# EAGLE schematic 8051 (EAGLE 7.2.0)
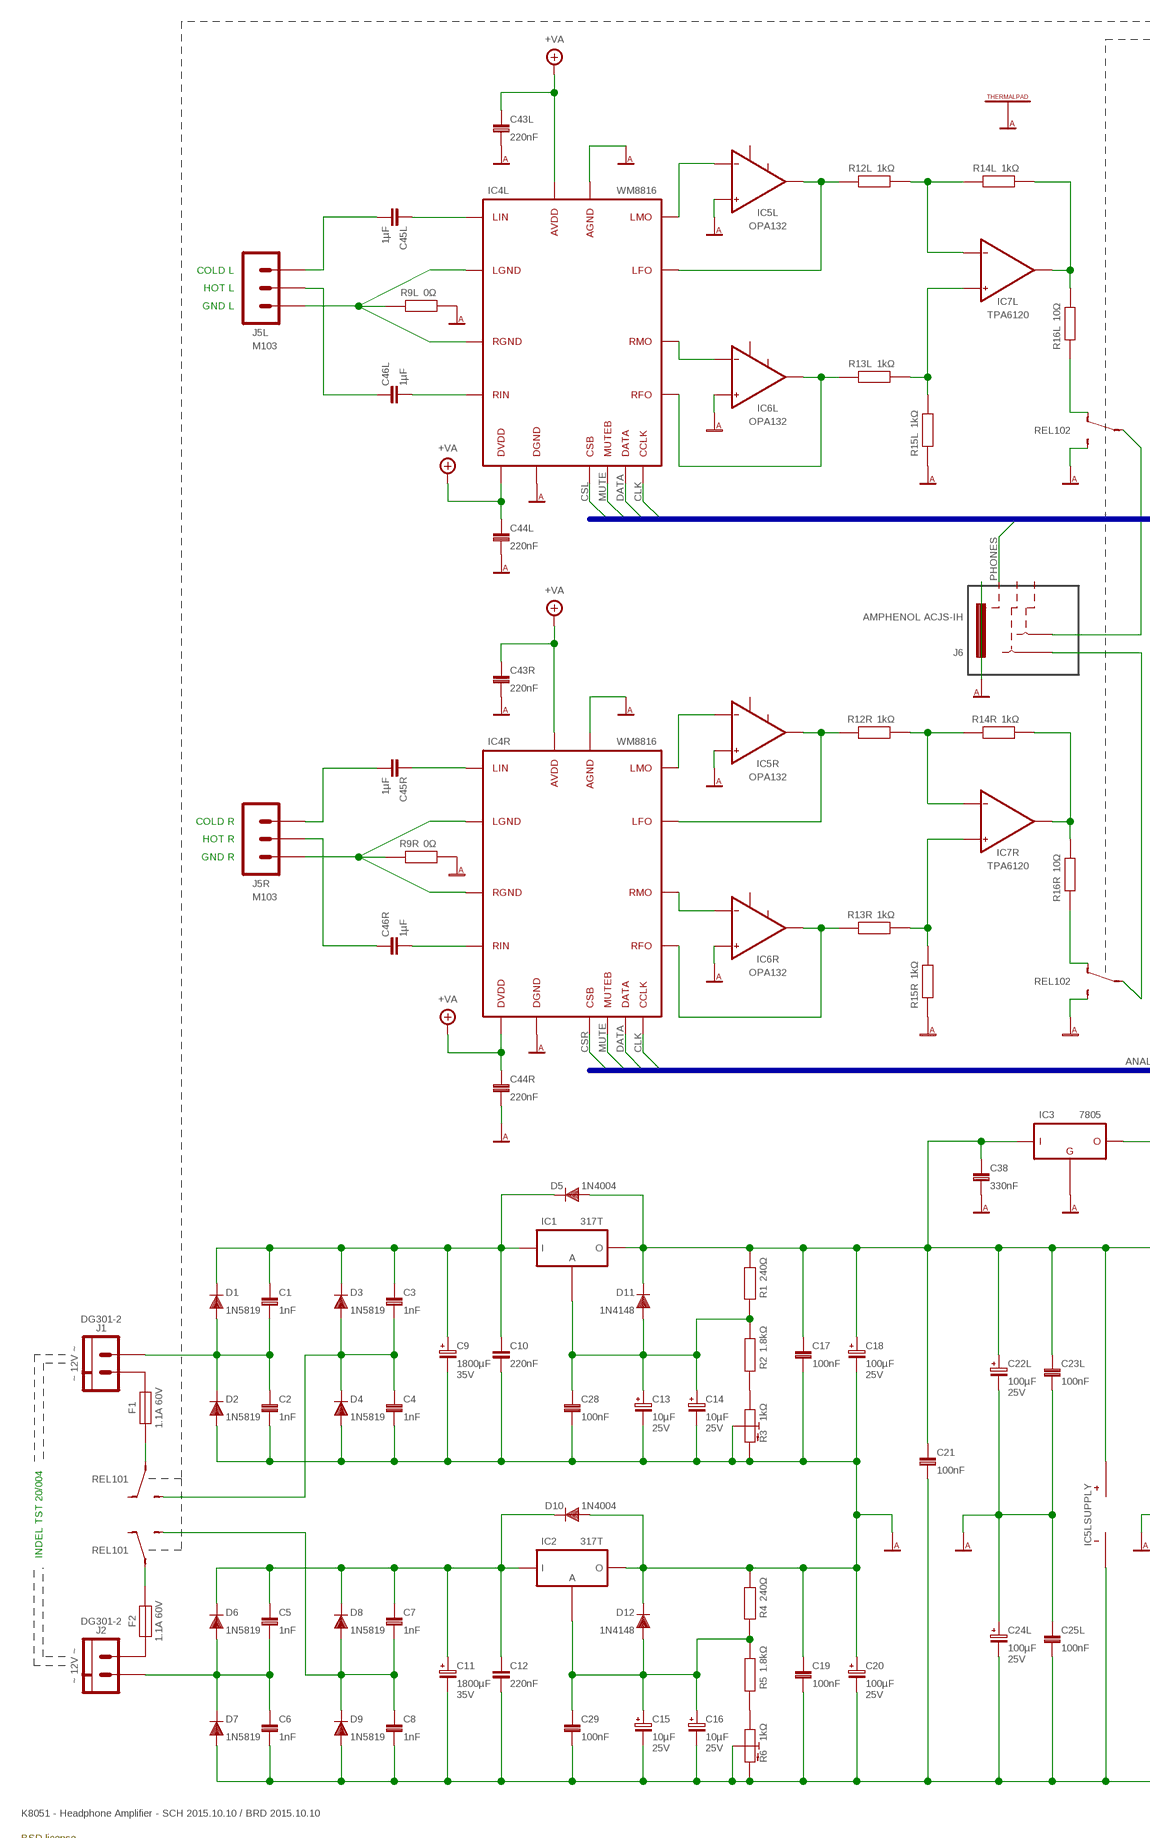
[diagram p0: schematic, sheet 1, part 1 of 2]
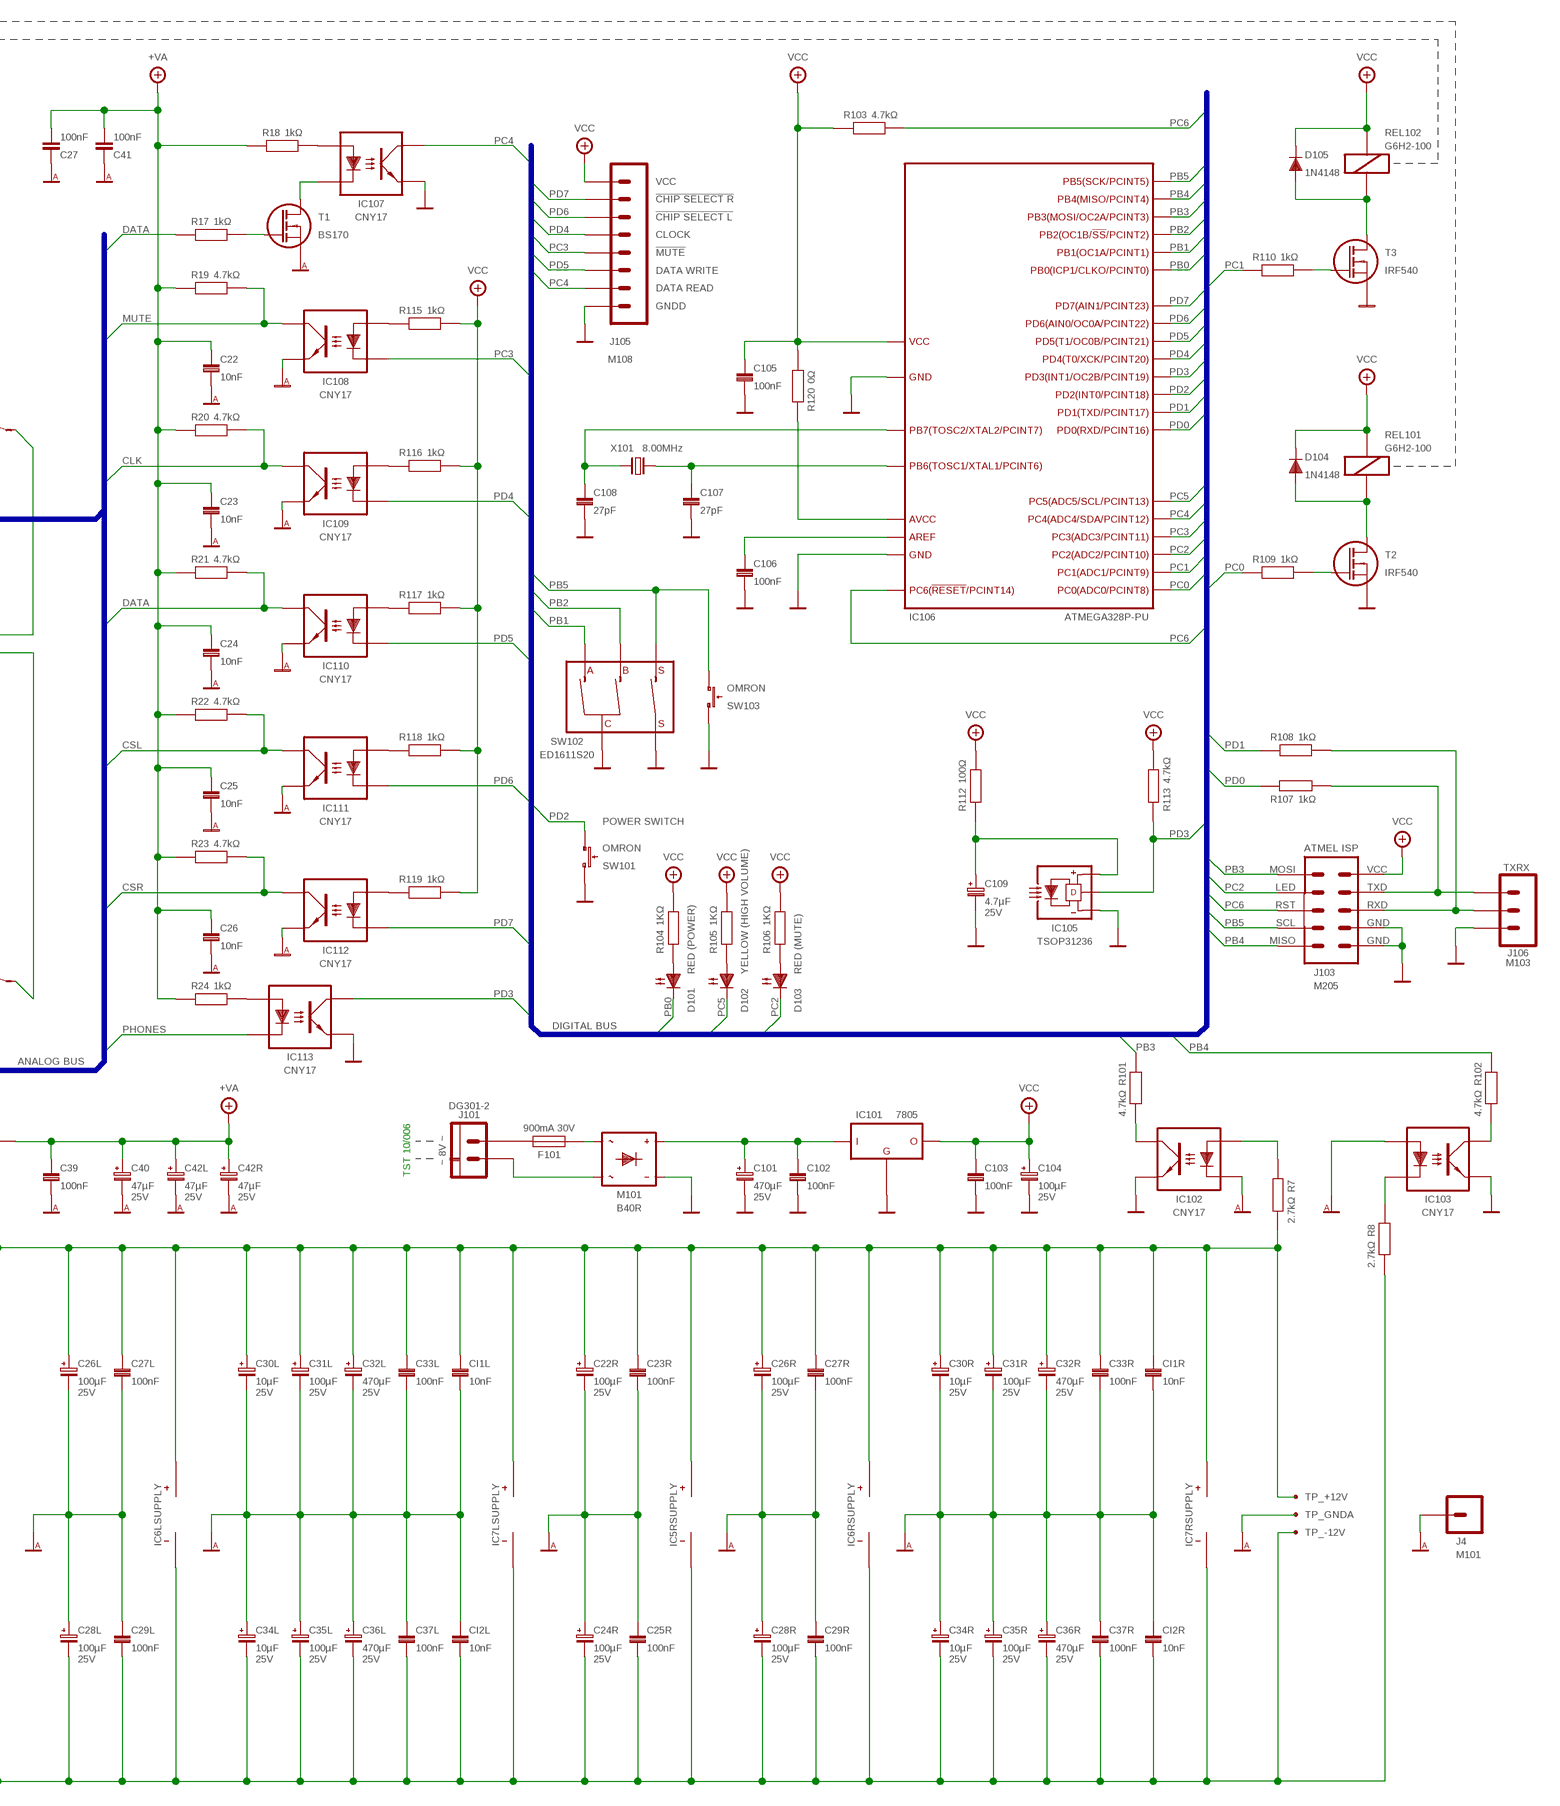
[diagram p1: schematic, sheet 1, part 2 of 2]

## Parts
C1  1nF  C075-032X103  [C075-032X103]
C2  1nF  C075-032X103  [C075-032X103]
C3  1nF  C075-032X103  [C075-032X103]
C4  1nF  C075-032X103  [C075-032X103]
C5  1nF  C075-032X103  [C075-032X103]
C6  1nF  C075-032X103  [C075-032X103]
C7  1nF  C075-032X103  [C075-032X103]
C8  1nF  C075-032X103  [C075-032X103]
C9  1800µF  FM1V182  [E-160-250-075-08]
C10  220nF  C102-064X133  [C102-064X133]
C11  1800µF  FM1V182  [E-160-250-075-08]
C12  220nF  C102-064X133  [C102-064X133]
C13  10µF  FM1E470  [E-050-110-020-05]
C14  10µF  FM1E470  [E-050-110-020-05]
C15  10µF  FM1E470  [E-050-110-020-05]
C16  10µF  FM1E470  [E-050-110-020-05]
C17  100nF  C075-042X103  [C075-042X103]
C18  100µF  FM1E101  [E-063-112-025-05]
C19  100nF  C075-042X103  [C075-042X103]
C20  100µF  FM1E101  [E-063-112-025-05]
C21  100nF  C075-042X103  [C075-042X103]
C22  10nF  CC0805  [C0805]
C22L  100µF  FM1E101  [E-063-112-025-05]
C22R  100µF  FM1E101  [E-063-112-025-05]
C23  10nF  CC0805  [C0805]
C23L  100nF  C075-042X103  [C075-042X103]
C23R  100nF  C075-042X103  [C075-042X103]
C24  10nF  CC0805  [C0805]
C24L  100µF  FM1E101  [E-063-112-025-05]
C24R  100µF  FM1E101  [E-063-112-025-05]
C25  10nF  CC0805  [C0805]
C25L  100nF  C075-042X103  [C075-042X103]
C25R  100nF  C075-042X103  [C075-042X103]
C26  10nF  CC0805  [C0805]
C26L  100µF  FM1E101  [E-063-112-025-05]
C26R  100µF  FM1E101  [E-063-112-025-05]
C27  100nF  C075-042X103  [C075-042X103]
C27L  100nF  C075-042X103  [C075-042X103]
C27R  100nF  C075-042X103  [C075-042X103]
C28  100nF  CC1812  [C1812]
C28L  100µF  FM1E101  [E-063-112-025-05]
C28R  100µF  FM1E101  [E-063-112-025-05]
C29  100nF  CC1812  [C1812]
C29L  100nF  C075-042X103  [C075-042X103]
C29R  100nF  C075-042X103  [C075-042X103]
C30L  10µF  FM1E470  [E-050-110-020-05]
C30R  10µF  FM1E470  [E-050-110-020-05]
C31L  100µF  FM1E101  [E-063-112-025-05]
C31R  100µF  FM1E101  [E-063-112-025-05]
C32L  470µF  FM1E471  [E-100-160-050-06]
C32R  470µF  FM1E471  [E-100-160-050-06]
C33L  100nF  C075-042X103  [C075-042X103]
C33R  100nF  C075-042X103  [C075-042X103]
C34L  10µF  FM1E470  [E-050-110-020-05]
C34R  10µF  FM1E470  [E-050-110-020-05]
C35L  100µF  FM1E101  [E-063-112-025-05]
C35R  100µF  FM1E101  [E-063-112-025-05]
C36L  470µF  FM1E471  [E-100-160-050-06]
C36R  470µF  FM1E471  [E-100-160-050-06]
C37L  100nF  C075-042X103  [C075-042X103]
C37R  100nF  C075-042X103  [C075-042X103]
C38  330nF  CC1206  [C1206]
C39  100nF  CC1206  [C1206]
C40  47µF  FM1E470  [E-050-110-020-05]
C41  100nF  C075-042X103  [C075-042X103]
C42L  47µF  FM1E470  [E-050-110-020-05]
C42R  47µF  FM1E470  [E-050-110-020-05]
C43L  220nF  C102-064X133  [C102-064X133]
C43R  220nF  C102-064X133  [C102-064X133]
C44L  220nF  C102-064X133  [C102-064X133]
C44R  220nF  C102-064X133  [C102-064X133]
C45L  1µF  C075-063X106  [C075-063X106]
C45R  1µF  C075-063X106  [C075-063X106]
C46L  1µF  C075-063X106  [C075-063X106]
C46R  1µF  C075-063X106  [C075-063X106]
C101  470µF  FM1E471  [E-100-160-050-06]
C102  100nF  CC1206  [C1206]
C103  100nF  CC1206  [C1206]
C104  100µF  FM1E101  [E-063-112-025-05]
C105  100nF  CC1206  [C1206]
C106  100nF  CC1206  [C1206]
C107  27pF  CC1206  [C1206]
C108  27pF  CC1206  [C1206]
C109  4.7µF  FM1E470  [E-050-110-020-05]
CI1L  10nF  CC0805K  [C0805K]
CI1R  10nF  CC0805K  [C0805K]
CI2L  10nF  CC0805K  [C0805K]
CI2R  10nF  CC0805K  [C0805K]
D1  1N5819  1N4004  [DO41-10]
D2  1N5819  1N4004  [DO41-10]
D3  1N5819  1N4004  [DO41-10]
D4  1N5819  1N4004  [DO41-10]
D5  1N4004  [DO41-10]
D6  1N5819  1N4004  [DO41-10]
D7  1N5819  1N4004  [DO41-10]
D8  1N5819  1N4004  [DO41-10]
D9  1N5819  1N4004  [DO41-10]
D10  1N4004  [DO41-10]
D11  1N4148  1N4148DO35-7  [DO35-7]
D12  1N4148  1N4148DO35-7  [DO35-7]
D101  RED (POWER)  LED3MM  [LED3MM]
D102  YELLOW (HIGH VOLUME)  LED3MM  [LED3MM]
D103  RED (MUTE)  LED3MM  [LED3MM]
D104  1N4148  1N4148DO35-7  [DO35-7]
D105  1N4148  1N4148DO35-7  [DO35-7]
F1  1.1A 60V  FUSE-LITTELFUSE-60R110  [LITTELFUSE-60R110]
F2  1.1A 60V  FUSE-LITTELFUSE-60R110  [LITTELFUSE-60R110]
F101  900mA 30V  FUSE-LITTELFUSE-30R090  [LITTELFUSE-30R090]
IC1  317T  LM317TS  [TO220]
IC2  317T  LM317TS  [TO220]
IC3  7805  LM78XX-C  [TO220]
IC4L  WM8816  [SO16W]
IC4R  WM8816  [SO16W]
IC5L  OPA132  [DIL08]
IC5R  OPA132  [DIL08]
IC6L  OPA132  [DIL08]
IC6R  OPA132  [DIL08]
IC7  TPA6120  [SO20-POWERPAD]
IC101  7805  LM78XX-C  [TO220]
IC102  CNY17  CNY17F  [DIL06]
IC103  CNY17  CNY17F  [DIL06]
IC105  TSOP31236  TSOP1736  [TSOP17XX]
IC106  ATMEGA328P-PU  [DIP254P800X550-28B]
IC107  CNY17  CNY17F  [DIL06]
IC108  CNY17  CNY17F  [DIL06]
IC109  CNY17  CNY17F  [DIL06]
IC110  CNY17  CNY17F  [DIL06]
IC111  CNY17  CNY17F  [DIL06]
IC112  CNY17  CNY17F  [DIL06]
IC113  CNY17  CNY17F  [DIL06]
J1  DG301-2  [DG301-2]
J2  DG301-2  [DG301-2]
J4  M101  1-1  [1-1]
J5L  M103  1-3  [1-3]
J5R  M103  1-3  [1-3]
J6  AMPHENOL ACJS-IH  JACK-FEMALE-STEREO  [JACK-FEMALE-STEREO]
J101  DG301-2  [DG301-2]
J103  M205  ATMEL-ISP-10-RXTX-V  [MM-10-V]
J105  M108  1-8  [1-8]
J106  M103  1-3  [1-3]
M101  B40R  B40C1500R  [RB1A]
R1  240Ω  RR1206  [R1206]
R2  1.8kΩ  RR1206  [R1206]
R3  1kΩ  POTB64Y  [POT_B64Y]
R4  240Ω  RR1206  [R1206]
R5  1.8kΩ  RR1206  [R1206]
R6  1kΩ  POTB64Y  [POT_B64Y]
R7  2.7kΩ  RR1206  [R1206]
R8  2.7kΩ  RR1206  [R1206]
R9L  0Ω  R0204/5  [0204/5]
R9R  0Ω  R0204/5  [0204/5]
R12L  1kΩ  R0204/5  [0204/5]
R12R  1kΩ  R0204/5  [0204/5]
R13L  1kΩ  R0204/5  [0204/5]
R13R  1kΩ  R0204/5  [0204/5]
R14L  1kΩ  R0204/5  [0204/5]
R14R  1kΩ  R0204/5  [0204/5]
R15L  1kΩ  R  [TPA_RF]
R15R  1kΩ  R  [TPA_RF]
R16L  10Ω  R0204/5  [0204/5]
R16R  10Ω  R0204/5  [0204/5]
R17  1kΩ  RR1206  [R1206]
R18  1kΩ  RR1206  [R1206]
R19  4.7kΩ  RR1206  [R1206]
R20  4.7kΩ  RR1206  [R1206]
R21  4.7kΩ  RR1206  [R1206]
R22  4.7kΩ  RR1206  [R1206]
R23  4.7kΩ  RR1206  [R1206]
R24  1kΩ  RR1206  [R1206]
R101  4.7kΩ  RR1206  [R1206]
R102  4.7kΩ  RR1206  [R1206]
R103  4.7kΩ  RR1206  [R1206]
R104  1KΩ  RR1206  [R1206]
R105  1KΩ  RR1206  [R1206]
R106  1KΩ  RR1206  [R1206]
R107  1kΩ  RR1206  [R1206]
R108  1kΩ  RR1206  [R1206]
R109  1kΩ  RR1206  [R1206]
R110  1kΩ  RR1206  [R1206]
R112  100Ω  RR1206  [R1206]
R113  4.7kΩ  RR1206  [R1206]
R115  1kΩ  RR1206  [R1206]
R116  1kΩ  RR1206  [R1206]
R117  1kΩ  RR1206  [R1206]
R118  1kΩ  RR1206  [R1206]
R119  1kΩ  RR1206  [R1206]
R120  0Ω  RR1206  [R1206]
REL101  G6H2-100  [G6H2-100]
REL102  G6H2-100  [G6H2-100]
SW101  OMRON  10-XXVERT  [B3F-31XX]
SW102  ED1611S20  [ED1611S-20]
SW103  OMRON  10-XXVERT  [B3F-31XX]
T1  BS170  BS170BENT  [TO92-DGS-BENT]
T2  IRF540  [TO220-GDS]
T3  IRF540  [TO220-GDS]
TP_+12V  TP  [TP]
TP_-12V  TP  [TP]
TP_GNDA  TP  [TP]
X101  8.00MHz  CRYSTALHC49S  [HC49/S]

## Nets
+VA: C22.1 C23.1 C24.1 C25.1 C26.1 C27.2 C39.1 C40.+ C41.2 C42L.+ C42R.+ C43L.1 C43R.1 C44L.1 C44R.1 IC3.3(OUT) IC4L.1(AVDD) IC4L.7(DVDD) IC4R.1(AVDD) IC4R.7(DVDD) R18.1 R19.1 R20.1 R21.1 R22.1 R23.1 R24.1
AUDIOIN_LC [ANALOG_LO]: C45L.2 J5L.1
AUDIOIN_LGND [ANALOG_LO]: IC4L.5(LGND) IC4L.12(RGND) J5L.3 R9L.1
AUDIOIN_LH [ANALOG_LO]: C46L.1 J5L.2
AUDIOIN_RC [ANALOG_LO]: C45R.2 J5R.1
AUDIOIN_RGND [ANALOG_LO]: IC4R.5(LGND) IC4R.12(RGND) J5R.3 R9R.1
AUDIOIN_RH [ANALOG_LO]: C46R.1 J5R.2
AVCC [DIGITAL_SUPPLY]: IC106.20(AVCC) R120.1
CLK [ANALOG]: IC4L.10(CCLK) IC4R.10(CCLK) IC109.5(COL) R20.2
CSL [ANALOG]: IC4L.6(CSB) IC111.5(COL) R22.2
CSR [ANALOG]: IC4R.6(CSB) IC112.5(COL) R23.2
DATA [ANALOG]: IC4L.9(DATA) IC4R.9(DATA) IC110.5(COL) R17.1 R21.2
GND [DIGITAL_SUPPLY]: C101.- C102.2 C103.2 C104.- C105.2 C106.2 C107.2 C108.2 C109.- IC101.2(GND) IC102.4(EMIT) IC103.4(EMIT) IC105.GND IC106.8(GND) IC106.22(GND) IC107.4(EMIT) IC113.4(EMIT) J103.8(GND) J103.10(GND) J105.1 J106.1 M101.- SW101.2(S) SW102.C SW102.S2 SW103.2(S) T2.S T3.S
GNDA [ANALOG]: C2.2 C4.2 C9.- C10.1 C13.- C14.- C17.2 C18.- C19.1 C20.+ C22.2 C22L.- C22R.- C23.2 C23L.2 C23R.2 C24.2 C24L.+ C24R.+ C25.2 C25L.1 C25R.1 C26.2 C26L.- C26R.- C27.1 C27L.2 C27R.2 C28.2 C28L.+ C28R.+ C29L.1 C29R.1 C30L.- C30R.- C31L.- C31R.- C32L.- C32R.- C33L.2 C33R.2 C34L.+ C34R.+ C35L.+ C35R.+ C36L.+ C36R.+ C37L.1 C37R.1 C38.2 C39.2 C40.- C41.1 C42L.- C42R.- C43L.2 C43R.2 C44L.2 C44R.2 CI1L.2 CI1R.2 CI2L.1 CI2R.1 D2.A D4.A D10.A D12.C IC2.2(OUT) IC3.2(GND) IC4L.11(DGND) IC4L.16(AGND) IC4R.11(DGND) IC4R.16(AGND) IC5L.3(+IN) IC5R.3(+IN) IC6L.3(+IN) IC6R.3(+IN) IC7.THERMAL(TPAD:THERMAL) IC102.2(C) IC103.1(A) IC108.4(EMIT) IC109.4(EMIT) IC110.4(EMIT) IC111.4(EMIT) IC112.4(EMIT) J4.1 J6.G R3.E R3.S R4.2 R9L.2 R9R.2 R15L.1 R15R.1 REL102.S1(2:S) REL102.S2(3:S) T1.S TP_GNDA.P$1
LFO_L [ANALOG_LO]: IC4L.3(LFO) IC5L.6(OUT) R12L.1
LFO_R [ANALOG_LO]: IC4R.3(LFO) IC5R.6(OUT) R12R.1
LIN_L [ANALOG_LO]: C45L.1 IC4L.4(LIN)
LIN_R [ANALOG_LO]: C45R.1 IC4R.4(LIN)
LMO_L [ANALOG]: IC4L.2(LMO) IC5L.2(-IN)
LMO_R [ANALOG]: IC4R.2(LMO) IC5R.2(-IN)
MUTE [ANALOG]: IC4L.8(MUTEB) IC4R.8(MUTEB) IC108.5(COL) R19.2
N$1 [DIGITAL_SIGNAL]: R110.2 T3.G
N$6: C106.1 IC106.21(AREF)
N$8 [ANALOG]: C15.+ C16.+ C29.1 D12.A IC2.1(ADJ) R4.1 R5.1
N$9 [ANALOG]: R5.2 R6.A
N$21: D103.A R106.1
N$23 [DIGITAL_SIGNAL]: C109.+ IC105.V+ R112.1
N$24 [DIGITAL_SUPPLY]: F101.2 M101.AC@1(~)
N$25 [DIGITAL_SUPPLY]: J101.1 M101.AC@2(~)
N$26: IC107.1(A) R18.2
N$27 [ANALOG]: C13.+ C14.+ C28.1 D11.A IC1.1(ADJ) R1.1 R2.1
N$32 [DIGITAL_SIGNAL]: D105.A REL102.10 T3.D
N$33 [ANALOG]: C1.2 C2.1 D1.A D2.C J1.2
N$35 [ANALOG]: C5.2 C6.1 D6.A D7.C J2.1
N$36 [ANALOG]: C7.2 C8.1 D8.A D9.C REL101.S1(2:S)
N$38 [ANALOG]: C5.1 C7.1 C11.+ C12.2 D6.C D8.C D10.C IC2.3(IN)
N$39 [ANALOG]: R2.2 R3.A
N$48 [ANALOG]: C1.1 C3.1 C9.+ C10.2 D1.C D3.C D5.C IC1.3(IN)
N$49 [ANALOG]: F1.1 REL101.P2(3:P)
N$50 [DIGITAL_SIGNAL]: C107.1 IC106.9(PB6) X101.1
N$52 [DIGITAL_SIGNAL]: C108.1 IC106.10(PB7) X101.2
N$53 [ANALOG]: C3.2 C4.1 D3.A D4.C REL101.S2(3:S)
N$54 [DIGITAL_SIGNAL]: IC111.1(A) R118.1
N$55 [DIGITAL_SIGNAL]: IC110.1(A) R117.1
N$56 [DIGITAL_SIGNAL]: IC109.1(A) R116.1
N$57 [DIGITAL_SIGNAL]: IC108.1(A) R115.1
N$58 [DIGITAL_SIGNAL]: IC112.1(A) R119.1
N$60 [DIGITAL_SIGNAL]: R109.2 T2.G
N$61 [DIGITAL_SIGNAL]: J103.4(TXD) J106.3 R107.2
N$62 [DIGITAL_SIGNAL]: D104.A REL101.10 T2.D
N$63 [ANALOG]: F2.1 REL101.P1(2:P)
N$69: D102.A R105.1
N$70 [DIGITAL_SIGNAL]: J103.6(RXD) J106.2 R108.2
N$71: D101.A R104.1
N$72: IC102.5(COL) R101.2
N$73: IC102.1(A) R7.1
N$74: IC103.5(COL) R102.2
N$75: F1.2 J1.1
N$76: IC103.2(C) R8.1
N$77: F2.2 J2.2
N$78 [DIGITAL_SUPPLY]: F101.1 J101.2
N$79: R17.2 T1.G
N$80 [ANALOG]: IC107.2(C) T1.D
N$81: IC113.1(A) R24.2
OUT_L: R16L.1 REL102.O2(3:O)
OUT_R: R16R.1 REL102.O1(2:O)
PB0 [DIGITAL_SIGNAL]: D101.K(C) IC106.14(PB0)
PB1 [DIGITAL_SIGNAL]: IC106.15(PB1) SW102.A
PB2 [DIGITAL_SIGNAL]: IC106.16(PB2) SW102.B
PB3 [DIGITAL_SIGNAL]: IC106.17(PB3) J103.1(MOSI) R101.1
PB4 [DIGITAL_SIGNAL]: IC106.18(PB4) J103.9(MISO) R102.1
PB5 [DIGITAL_SIGNAL]: IC106.19(PB5) J103.7(SCL) SW102.S1 SW103.1(P)
PC0 [DIGITAL_SIGNAL]: IC106.23(PC0) R109.1
PC1 [DIGITAL_SIGNAL]: IC106.24(PC1) R110.1
PC2 [DIGITAL_SIGNAL]: D103.K(C) IC106.25(PC2) J103.3(LED)
PC3 [DIGITAL_SIGNAL]: IC106.26(PC3) IC108.2(C) J105.4
PC4 [DIGITAL_SIGNAL]: IC106.27(PC4) IC107.5(COL) J105.2
PC5 [DIGITAL_SIGNAL]: D102.K(C) IC106.28(PC5)
PC6 [DIGITAL_SIGNAL]: IC106.1(PC6) J103.5(RST) R103.2
PD0 [DIGITAL_SIGNAL]: IC106.2(PD0) R107.1
PD1 [DIGITAL_SIGNAL]: IC106.3(PD1) R108.1
PD2 [DIGITAL_SIGNAL]: IC106.4(PD2) SW101.1(P)
PD3 [DIGITAL_SIGNAL]: IC105.OUT IC106.5(PD3) IC113.5(COL) R113.2
PD4 [DIGITAL_SIGNAL]: IC106.6(PD4) IC109.2(C) J105.5
PD5 [DIGITAL_SIGNAL]: IC106.11(PD5) IC110.2(C) J105.3
PD6 [DIGITAL_SIGNAL]: IC106.12(PD6) IC111.2(C) J105.6
PD7 [DIGITAL_SIGNAL]: IC106.13(PD7) IC112.2(C) J105.7
PHONES: IC113.2(C) J6.GOFF
PHONES_L [ANALOG]: J6.L REL102.P2(3:P)
PHONES_R [ANALOG]: J6.R REL102.P1(2:P)
RFO_L [ANALOG_LO]: IC4L.14(RFO) IC6L.6(OUT) R13L.1
RFO_R [ANALOG_LO]: IC4R.14(RFO) IC6R.6(OUT) R13R.1
RIN_L [ANALOG_LO]: C46L.2 IC4L.13(RIN)
RIN_R [ANALOG_LO]: C46R.2 IC4R.13(RIN)
RMO_L [ANALOG]: IC4L.15(RMO) IC6L.2(-IN)
RMO_R [ANALOG]: IC4R.15(RMO) IC6R.2(-IN)
TPANEG_L [ANALOG]: IC7.5(L:IN-) R12L.2 R14L.1
TPANEG_R [ANALOG]: IC7.16(R:IN-) R12R.2 R14R.1
TPAOUT_L [ANALOG]: IC7.2(L:OUT) R14L.2 R16L.2
TPAOUT_R [ANALOG]: IC7.19(R:OUT) R14R.2 R16R.2
TPAPOS_L [ANALOG]: IC7.4(L:IN+) R13L.2 R15L.2
TPAPOS_R [ANALOG]: IC7.17(R:IN+) R13R.2 R15R.2
V+ [ANALOG]: C17.1 C18.+ C21.1 C22L.+ C22R.+ C23L.1 C23R.1 C26L.+ C26R.+ C27L.1 C27R.1 C30L.+ C30R.+ C31L.+ C31R.+ C32L.+ C32R.+ C33L.1 C33R.1 C38.1 CI1L.1 CI1R.1 D5.A D11.C IC1.2(OUT) IC3.1(IN) IC5L.7(SUPPLY:V+) IC5R.7(SUPPLY:V+) IC6L.7(SUPPLY:V+) IC6R.7(SUPPLY:V+) IC7.3(LSUPPLY:V+) IC7.18(RSUPPLY:V+) R1.2 R7.2 TP_+12V.P$1
V- [ANALOG]: C6.2 C8.2 C11.- C12.1 C15.- C16.- C19.2 C20.- C21.2 C24L.- C24R.- C25L.2 C25R.2 C28L.- C28R.- C29.2 C29L.2 C29R.2 C34L.- C34R.- C35L.- C35R.- C36L.- C36R.- C37L.2 C37R.2 CI2L.2 CI2R.2 D7.A D9.A IC5L.4(SUPPLY:V-) IC5R.4(SUPPLY:V-) IC6L.4(SUPPLY:V-) IC6R.4(SUPPLY:V-) IC7.1(LSUPPLY:V-) IC7.20(RSUPPLY:V-) R6.E R6.S R8.2 TP_-12V.P$1
VCC [DIGITAL_SUPPLY]: C103.1 C104.+ C105.1 D104.C D105.C IC101.3(OUT) IC106.7(VCC) J103.2(VCC) J105.8 R103.1 R104.2 R105.2 R106.2 R112.2 R113.1 R115.2 R116.2 R117.2 R118.2 R119.2 R120.2 REL101.1 REL102.1
VD_BEFOREVREG [DIGITAL_SUPPLY]: C101.+ C102.1 IC101.1(IN) M101.+
Unconnected: IC5L.1(O1) IC5L.8(O8) IC5R.1(O1) IC5R.8(O8) IC6L.1(O1) IC6L.8(O8) IC6R.1(O1) IC6R.8(O8) J6.LOFF J6.ROFF REL101.O1(2:O) REL101.O2(3:O)

## Buses
PB[0..5],PC[0..6],PD[0..7]
MUTE,CLK,DATA,CSL,CSR,PHONES

## Notes on the sheet
- VCC
  !CHIP SELECT R!
  !CHIP SELECT L!
  CLOCK
  !MUTE!
  DATA WRITE
  DATA READ
  GNDD
- COLD L
  HOT L
  GND L
- POWER SWITCH
- COLD R
  HOT R
  GND R
- ATMEL ISP
- TXRX
- DIGITAL BUS
- ANALOG BUS
- TST 10/006 | ~ 8V ~
- ~ 12V ~
- INDEL TST 20/004
- ~ 12V ~
- K8051 - Headphone Amplifier - SCH 2015.10.10 / BRD 2015.10.10

## Library data of the parts
C1-C8 C10 C12 C17 C19 C21-C23 C23L C23R C24 C25 C25L C25R C26 C27 C27L C27R C28 C29 C29L C29R C33L C33R C37L C37R C38 C39 C41 C43L C43R C44L C44R C45L C45R C46L C46R C102 C103 C105-C108 CI1L CI1R CI2L CI2R = rcl:C
C9 C11 = capacitors-panasonic-fm-a:FM1V182: 1800µF / 35V; VOLTAGE: 35V
C13-C16 C30L C30R C34L C34R C109 = capacitors-panasonic-fm-a:FM1E470: 47µF / 25V; VALUE: 47µF; VOLTAGE: 25V
C18 C20 C22L C22R C24L C24R C26L C26R C28L C28R C31L C31R C35L C35R C104 = capacitors-panasonic-fm-a:FM1E101: 100µF / 25V; VOLTAGE: 25V
C32L C32R C36L C36R C101 = capacitors-panasonic-fm-a:FM1E471: 470µF / 25V; VOLTAGE: 25V
C40 C42L C42R = capacitors-panasonic-fm-a:FM1E470: 47µF / 25V; VOLTAGE: 25V
D1-D10 = diodes:1N4004: DIODE general purpose rectifier, 1 A
D11 D12 D104 D105 = diodes:1N4148: DIODE high speed (Philips)
D101-D103 = led:LED: LED OSRAM: - CHIPLED LG R971, LG N971, LY N971, LG Q971, LY Q971, LO R971, LY R971 LH N974, LH R974 LS Q976, LO Q976, LY Q976 LO Q996 - Hyper CHIPLED LW Q18S LB Q993, LB Q99A, LB R99A - SideLED LS A670, LO A670, LY A670, LG A670, LP A670 LB A673, LV A673, LT A673, LW A673 LH A674 LY A675 LS A676, LA A676, LO A676, LY A676, LW A676 LS A679, LY A679, LG A679 - Hyper Micro SIDELED® LS Y876, LA Y876, LO Y876, LY Y876 LT Y87S - SmartLED LW L88C, LW L88S LB L89C, LB L89S, LG L890 LS L89K, LO L89K, LY L89K LS L896, LA L896, LO L896, LY L896 - TOPLED LS T670, LO T670, LY T670, LG T670, LP T670 LSG T670, LSP T670, LSY T670, LOP T670, LYG T670 LG T671, LOG T671, LSG T671 LB T673, LV T673, LT T673, LW T673 LH T674 LS T676, LA T676, LO T676, LY T676, LB T676, LH T676, LSB T676, LW T676 LB T67C, LV T67C, LT T67C, LS T67K, LO T67K, LY T67K, LW E67C LS E67B, LA E67B, LO E67B, LY E67B, LB E67C, LV E67C, LT E67C LW T67C LS T679, LY T679, LG T679 LS T770, LO T770, LY T770, LG T770, LP T770 LB T773, LV T773, LT T773, LW T773 LH T774 LS E675, LA E675, LY E675, LS T675 LS T776, LA T776, LO T776, LY T776, LB T776 LHGB T686 LT T68C, LB T68C - Hyper Mini TOPLED® LB M676 - Mini TOPLED Santana® LG M470 LS M47K, LO M47K, LY M47K Source: http://www.osram.convergy.de LUXEON: - LUMILED® LXK2-PW12-R00, LXK2-PW12-S00, LXK2-PW14-U00, LXK2-PW14-V00 LXK2-PM12-R00, LXK2-PM12-S00, LXK2-PM14-U00 LXK2-PE12-Q00, LXK2-PE12-R00, LXK2-PE12-S00, LXK2-PE14-T00, LXK2-PE14-U00 LXK2-PB12-K00, LXK2-PB12-L00, LXK2-PB12-M00, LXK2-PB14-N00, LXK2-PB14-P00, LXK2-PB14-Q00 LXK2-PR12-L00, LXK2-PR12-M00, LXK2-PR14-Q00, LXK2-PR14-R00 LXK2-PD12-Q00, LXK2-PD12-R00, LXK2-PD12-S00 LXK2-PH12-R00, LXK2-PH12-S00 LXK2-PL12-P00, LXK2-PL12-Q00, LXK2-PL12-R00 Source: www.luxeon.com KINGBRIGHT: KA-3528ASYC Source: www.kingbright.com
F1 F2 F101 = fuse:FUSE
IC1 IC2 = vreg:LM317TS
IC3 IC101 = vreg:LM78XX
IC4L IC4R = ic-wolfson:WM8816
IC5L IC5R IC6L IC6R = ic-texasinstruments:OPA132
IC7 = ic-texasinstruments:TPA6120
IC102 IC103 IC107-IC113 = optocoupler:CNY17F: SIEMENS OPTO COUPLER; MF: VISHAY/TELEFUNKEN; MPN: CNY17F-3; OC_FARNELL: 1469473; OC_NEWARK: 58K0172
IC105 = tsop:TSOP1736: ir receiver and demodulator - 36kHz
IC106 = ic-atmel:ATMEGA328P-PU
J1 J2 J101 = con-ark:?-2: 2-poles Terminal Block
J4 = con-pins:1-1
J5L J5R J106 = con-pins:1-3
J6 = con-audio:JACK-FEMALE-STEREO
J103 = atmel-isp:ATMEL-ISP-10-RXTX
J105 = con-pins:1-8
M101 = rectifiers:B40C1500R
R1 R2 R4 R5 R7 R8 R9L R9R R12L R12R R13L R13R R14L R14R R15L R15R R16L R16R R17-R24 R101-R110 R112 R113 R115-R120 = rcl:R
R3 R6 = rcl:POT
REL101 REL102 = relay:G6H2-100: RELAY 2 x switch, 0.5 A/125 V AC, 1 A/30 V DC, Omron; OC_FARNELL: unknown; OC_NEWARK: unknown
SW101 SW103 = sw-omron:10-XX: OMRON SWITCH
SW102 = encoders:ED1611S
T1 = transistors:BS170
T2 T3 = transistors:IRF540
TP_+12V TP_-12V TP_GNDA = supply:TP
X101 = crystal:CRYSTAL

## Net classes
1 ANALOG: clearance 0.305 mm
2 ANALOG_LO: clearance 0.457 mm
11 DIGITAL_SUPPLY: width 0.406 mm, clearance 0.254 mm
12 DIGITAL_SIGNAL: width 0.305 mm, clearance 0.254 mm